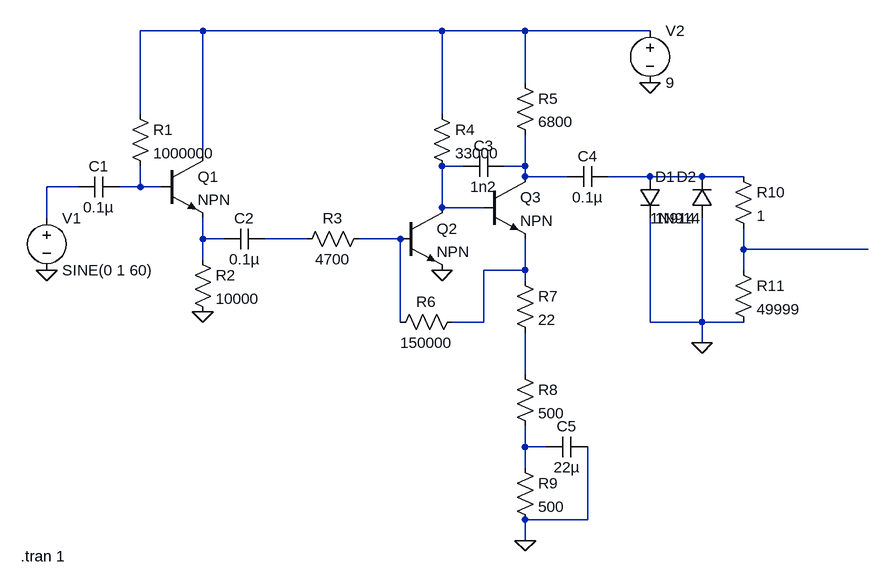
[diagram p0: schematic JSHFuzz.asc]
JSHFuzz.asc, the LTspice schematic file:
Version 4
SHEET 1 1332 680
WIRE 304 -272 208 -272
WIRE 672 -272 304 -272
WIRE 800 -272 672 -272
WIRE 992 -272 800 -272
WIRE 800 -192 800 -272
WIRE 208 -144 208 -272
WIRE 672 -144 672 -272
WIRE 304 -80 304 -272
WIRE 704 -64 672 -64
WIRE 800 -64 800 -112
WIRE 800 -64 768 -64
WIRE 800 -48 800 -64
WIRE 864 -48 800 -48
WIRE 992 -48 928 -48
WIRE 1072 -48 992 -48
WIRE 1136 -48 1072 -48
WIRE 112 -32 64 -32
WIRE 208 -32 208 -64
WIRE 208 -32 176 -32
WIRE 240 -32 208 -32
WIRE 672 0 672 -64
WIRE 736 0 672 0
WIRE 64 16 64 -32
WIRE 304 48 304 16
WIRE 336 48 304 48
WIRE 464 48 400 48
WIRE 608 48 544 48
WIRE 1136 64 1136 32
WIRE 1328 64 1136 64
WIRE 304 80 304 48
WIRE 800 96 800 48
WIRE 800 96 736 96
WIRE 1136 96 1136 64
WIRE 800 112 800 96
WIRE 608 176 608 48
WIRE 736 176 736 96
WIRE 736 176 688 176
WIRE 992 176 992 16
WIRE 1072 176 1072 16
WIRE 1072 176 992 176
WIRE 1136 176 1072 176
WIRE 1072 208 1072 176
WIRE 800 256 800 192
WIRE 800 368 800 336
WIRE 832 368 800 368
WIRE 800 400 800 368
WIRE 896 480 896 368
WIRE 896 480 800 480
WIRE 800 512 800 480
FLAG 64 96 0
FLAG 304 160 0
FLAG 672 96 0
FLAG 1072 208 0
FLAG 800 512 0
FLAG 992 -192 0
SYMBOL voltage 64 0 R0
WINDOW 123 0 0 Left 0
WINDOW 39 0 0 Left 0
SYMATTR InstName V1
SYMATTR Value SINE(0 1 60)
SYMBOL cap 176 -48 R90
WINDOW 0 0 32 VBottom 2
WINDOW 3 32 32 VTop 2
SYMATTR InstName C1
SYMATTR Value 0.1µ
SYMBOL res 192 -160 R0
SYMATTR InstName R1
SYMATTR Value 1000000
SYMBOL npn 240 -80 R0
SYMATTR InstName Q1
SYMBOL res 288 64 R0
SYMATTR InstName R2
SYMATTR Value 10000
SYMBOL cap 400 32 R90
WINDOW 0 0 32 VBottom 2
WINDOW 3 32 32 VTop 2
SYMATTR InstName C2
SYMATTR Value 0.1µ
SYMBOL res 560 32 R90
WINDOW 0 0 56 VBottom 2
WINDOW 3 32 56 VTop 2
SYMATTR InstName R3
SYMATTR Value 4700
SYMBOL npn 608 0 R0
SYMATTR InstName Q2
SYMBOL npn 736 -48 R0
SYMATTR InstName Q3
SYMBOL res 656 -160 R0
SYMATTR InstName R4
SYMATTR Value 33000
SYMBOL cap 768 -80 R90
WINDOW 0 0 32 VBottom 2
WINDOW 3 32 32 VTop 2
SYMATTR InstName C3
SYMATTR Value 1n2
SYMBOL res 784 -208 R0
SYMATTR InstName R5
SYMATTR Value 6800
SYMBOL voltage 992 -288 R0
SYMATTR InstName V2
SYMATTR Value 9
SYMBOL cap 928 -64 R90
WINDOW 0 0 32 VBottom 2
WINDOW 3 32 32 VTop 2
SYMATTR InstName C4
SYMATTR Value 0.1µ
SYMBOL res 704 160 R90
WINDOW 0 0 56 VBottom 2
WINDOW 3 32 56 VTop 2
SYMATTR InstName R6
SYMATTR Value 150000
SYMBOL res 784 96 R0
SYMATTR InstName R7
SYMATTR Value 22
SYMBOL res 784 240 R0
SYMATTR InstName R8
SYMATTR Value 500
SYMBOL cap 896 352 R90
WINDOW 0 0 32 VBottom 2
WINDOW 3 32 32 VTop 2
SYMATTR InstName C5
SYMATTR Value 22µ
SYMBOL res 784 384 R0
SYMATTR InstName R9
SYMATTR Value 500
SYMBOL diode 976 -48 R0
SYMATTR InstName D1
SYMATTR Value 1N914
SYMBOL diode 1088 16 R180
WINDOW 0 24 64 Left 2
WINDOW 3 24 0 Left 2
SYMATTR InstName D2
SYMATTR Value 1N914
SYMBOL res 1120 -64 R0
SYMATTR InstName R10
SYMATTR Value 1
SYMBOL res 1120 80 R0
SYMATTR InstName R11
SYMATTR Value 49999
TEXT 24 536 Left 2 !.tran 1

The netlist it stands for:
* JSHFuzz.asc
V1 N005 0 SINE(0 1 60)
C1 N006 N005 0.1µ
R1 N001 N006 1000000
Q1 N001 N006 N007 0 NPN
R2 N007 0 10000
C2 N008 N007 0.1µ
R3 N009 N008 4700
Q2 N002 N009 0 0 NPN
Q3 N003 N002 N011 0 NPN
R4 N001 N002 33000
C3 N003 N002 1n2
R5 N001 N003 6800
V2 N001 0 9
C4 N004 N003 0.1µ
R6 N011 N009 150000
R7 N011 N012 22
R8 N012 N013 500
C5 0 N013 22µ
R9 N013 0 500
D1 N004 0 1N914
D2 0 N004 1N914
R10 N004 N010 1
R11 N010 0 49999
.model D D
.lib standard.dio
.model NPN NPN
.model PNP PNP
.lib standard.bjt
.tran 1
.backanno
.end